# Altium schematic sheet S3P.SchDoc
size 297 x 209 mm
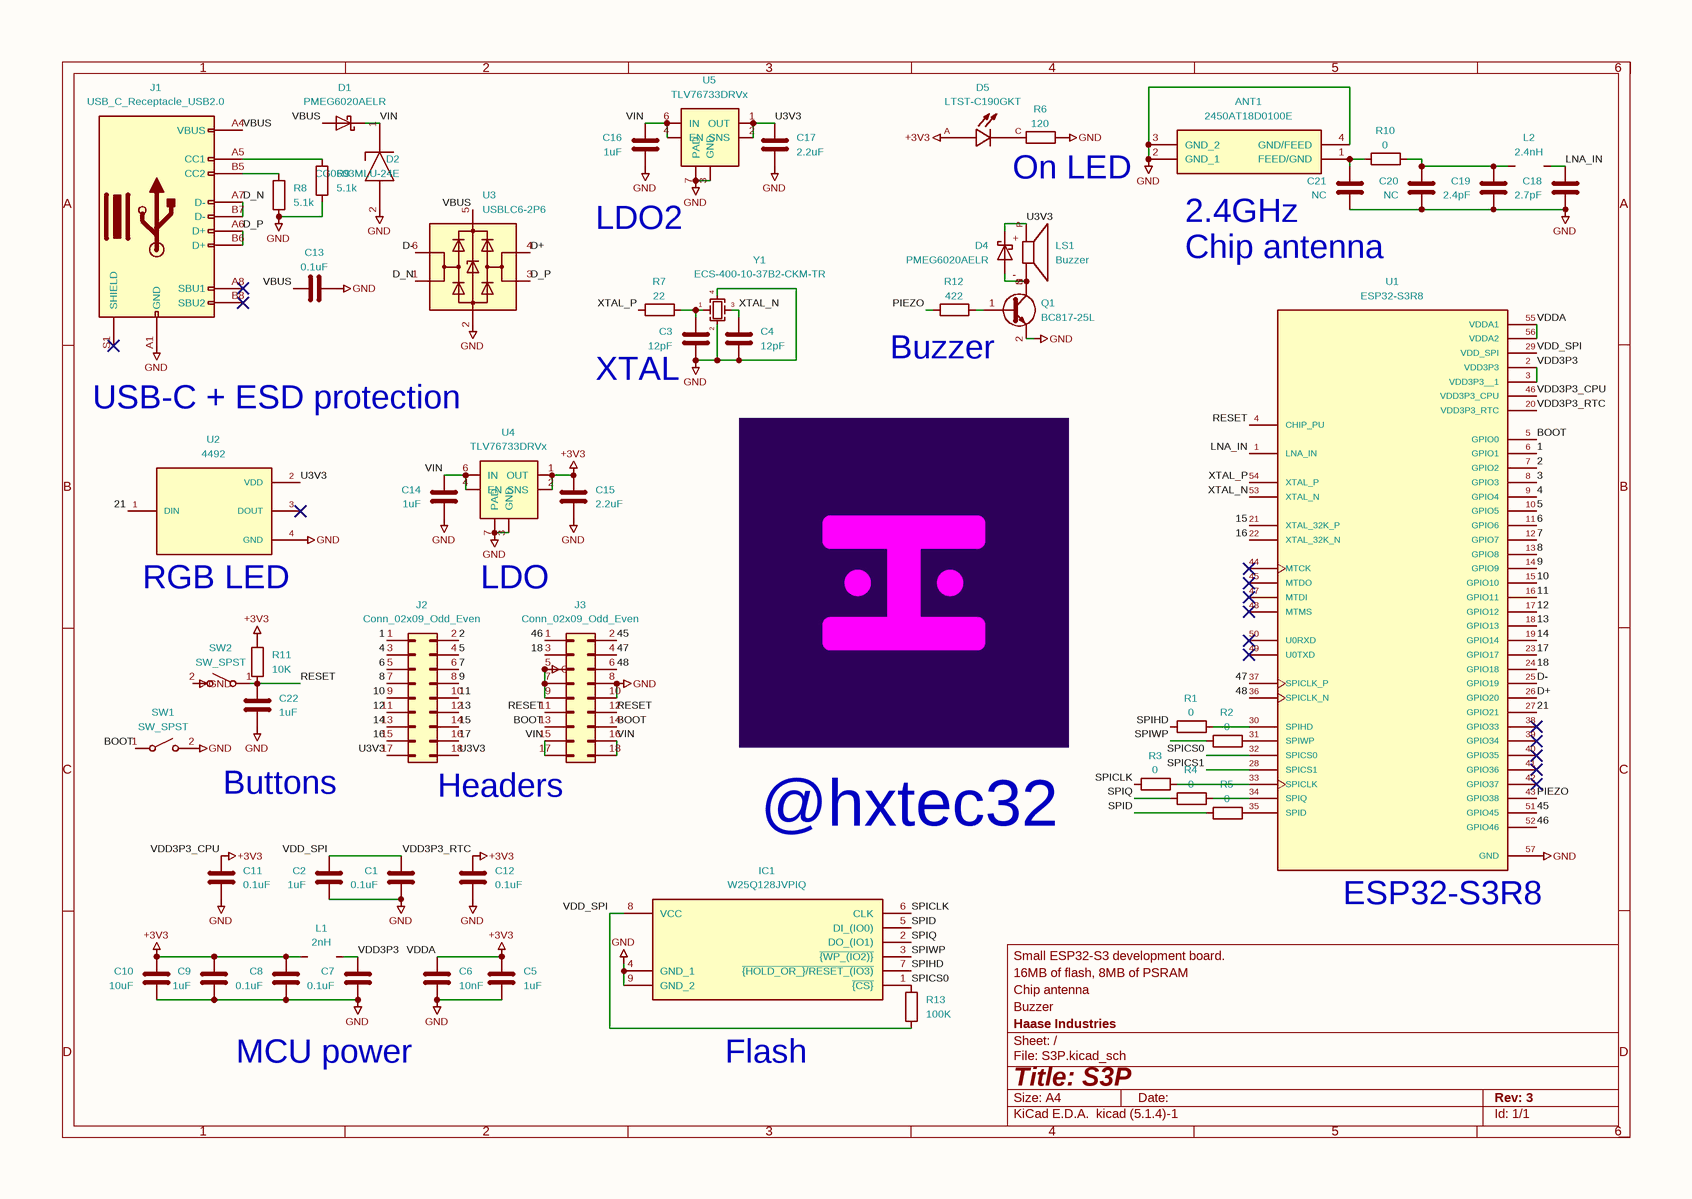
[diagram p0: S3P.SchDoc]

## Parts
ANT1  2450AT18D0100E  [2450AT18D0100E]
C1  0.1uF  [R_0402_1005Metric]
C2  1uF  [R_0402_1005Metric]
C3  12pF  [R_0201_0603Metric]
C4  12pF  [R_0201_0603Metric]
C5  1uF  [R_0402_1005Metric]
C6  10nF  [R_0201_0603Metric]
C7  0.1uF  [R_0402_1005Metric]
C8  0.1uF  [R_0402_1005Metric]
C9  1uF  [R_0402_1005Metric]
C10  10uF  [R_0603_1608Metric]
C11  0.1uF  [R_0402_1005Metric]
C12  0.1uF  [R_0402_1005Metric]
C13  0.1uF  [R_0402_1005Metric]
C14  1uF  [R_0603_1608Metric]
C15  2.2uF  [R_0402_1005Metric]
C16  1uF  [R_0603_1608Metric]
C17  2.2uF  [R_0402_1005Metric]
C18  2.7pF  [R_0201_0603Metric]
C19  2.4pF  [R_0201_0603Metric]
C20  NC  [R_0201_0603Metric]
C21  NC  [R_0201_0603Metric]
C22  1uF  [R_0402_1005Metric]
D1  PMEG6020AELR  [Nexperia_CFP3_SOD-123W]
D2  CG0603MLU-24E  [DIONC1608X55N]
D4  PMEG6020AELR  [Nexperia_CFP3_SOD-123W]
D5  LTST-C190GKT  [LEDC1608X35N]
IC1  W25Q128JVPIQ  [SON127P600X500X80-9N-D]
J1  USB_C_Receptacle_USB2.0  [USB_C_Receptacle_GCT_USB4105-xx-A_16P_TopMnt_Horizontal]
J2  Conn_02x09_Odd_Even  [PinHeader_2x09_P2.54mm_Vertical]
J3  Conn_02x09_Odd_Even  [PinHeader_2x09_P2.54mm_Vertical]
L1  2nH  [L_0402_1005Metric]
L2  2.4nH  [L_0201_0603Metric]
LS1  Buzzer  [XDCR_CMT-0525-75-SMT-TR]
Q1  BC817-25L  [SOT-23]
R1  0  [R_0201_0603Metric]
R2  0  [R_0201_0603Metric]
R3  0  [R_0201_0603Metric]
R4  0  [R_0201_0603Metric]
R5  0  [R_0201_0603Metric]
R6  120  [R_0402_1005Metric]
R7  22  [R_0402_1005Metric]
R8  5.1k  [R_0402_1005Metric]
R9  5.1k  [R_0402_1005Metric]
R10  0  [R_0201_0603Metric]
R11  10K  [R_0402_1005Metric]
R12  422  [R_0402_1005Metric]
R13  100K  [R_0201_0603Metric]
SW1  SW_SPST  [SW_SPST_PTS810]
SW2  SW_SPST  [SW_SPST_PTS810]
U1  ESP32-S3R8  [QFN40P700X700X90-57N-D]
U2  4492  [SK6805-EC15]
U3  USBLC6-2P6  [SOT-666]
U4  TLV76733DRVx  [WSON-6-1EP_2x2mm_P0.65mm_EP1x1.6mm_ThermalVias]
U5  TLV76733DRVx  [WSON-6-1EP_2x2mm_P0.65mm_EP1x1.6mm_ThermalVias]
Y1  ECS-400-10-37B2-CKM-TR  [Crystal_SMD_2016-4Pin_2.0x1.6mm]

## Nets
GND: ANT1.2(GND_1) ANT1.3(GND_2) ANT1.4(GND/FEED) C1.2 C2.2 C3.2 C4.2 C5.2 C6.2 C7.2 C8.2 C9.2 C10.2 C11.2 C12.2 C13.2 C14.2 C15.2 C16.2 C17.2 C18.2 C19.2 C20.2 C21.2 C22.2 D2.2(A) IC1.4(GND_1) IC1.9(GND_2) J1.A1(GND) J3.5(Pin_5) J3.7(Pin_7) J3.8(Pin_8) J3.9(Pin_9) J3.10(Pin_10) Q1.2(E) R6.2 R8.2 R9.2 SW1.2(B) SW2.2(B) U1.57(GND) U2.4(GND) U3.2(GND) U4.3(GND) U4.7(PAD) U5.3(GND) U5.7(PAD) Y1.2 Y1.4
VDD3P3_CPU: C5.1 C6.1 C8.1 C9.1 C10.1 C11.1 C12.1 C15.1 D5.A L1.2 R11.1 U1.20(VDD3P3_RTC) U1.46(VDD3P3_CPU) U1.55(VDDA1) U1.56(VDDA2) U4.1(OUT) U4.2(SNS)  [also labelled +3V3, VDD3P3_RTC, VDDA]
1: J2.1(Pin_1) U1.6(GPIO1)
2: J2.2(Pin_2) U1.7(GPIO2)
3: U1.8(GPIO3)
4: J2.3(Pin_3) U1.9(GPIO4)
5: J2.4(Pin_4) U1.10(GPIO5)
6: J2.5(Pin_5) U1.11(GPIO6)
7: J2.6(Pin_6) U1.12(GPIO7)
8: J2.7(Pin_7) U1.13(GPIO8)
9: J2.8(Pin_8) U1.14(GPIO9)
10: J2.9(Pin_9) U1.15(GPIO10)
11: J2.10(Pin_10) U1.16(GPIO11)
12: J2.11(Pin_11) U1.17(GPIO12)
13: J2.12(Pin_12) U1.18(GPIO13)
14: J2.13(Pin_13) U1.19(GPIO14)
15: J2.14(Pin_14) U1.21(XTAL_32K_P)
16: J2.15(Pin_15) U1.22(XTAL_32K_N)
17: J2.16(Pin_16) U1.23(GPIO17)
18: J3.3(Pin_3) U1.24(GPIO18)
21: U1.27(GPIO21) U2.1(DIN)
45: J3.2(Pin_2) U1.51(GPIO45)
46: J3.1(Pin_1) U1.52(GPIO46)
47: J3.4(Pin_4) U1.37(SPICLK_P)
48: J3.6(Pin_6) U1.36(SPICLK_N)
BOOT: J3.13(Pin_13) J3.14(Pin_14) SW1.1(A) U1.5(GPIO0)
D+: U1.26(GPIO20) U3.4(I/O2)
D-: U1.25(GPIO19) U3.6(I/O1)
D_N: J1.A7(D-) J1.B7(D-) U3.1(I/O1)
D_P: J1.A6(D+) J1.B6(D+) U3.3(I/O2)
LNA_IN: C18.1 L2.1 U1.1(LNA_IN)
PIEZO: R12.1 U1.43(GPIO38)
RESET: C22.1 J3.11(Pin_11) J3.12(Pin_12) R11.2 SW2.1(A) U1.4(CHIP_PU)
SPICLK: IC1.6(CLK) R3.1
SPICS0: IC1.1(~{{CS}}) R13.1 U1.32(SPICS0)
SPICS1: U1.28(SPICS1)
SPID: IC1.5(DI_(IO0)) R5.1
SPIHD: IC1.7(~{{HOLD_OR_}/RESET_(IO3)}) R1.1
SPIQ: IC1.2(DO_(IO1)) R4.1
SPIWP: IC1.3(~{{WP_(IO2)}}) R2.1
U3V3: C17.1 D4.1(K) J2.17(Pin_17) J2.18(Pin_18) LS1.P U2.2(VDD) U5.1(OUT) U5.2(SNS)
VBUS: C13.1 D1.2(A) J1.A4(VBUS) U3.5(VBUS)
VDD3P3: C7.1 L1.1 U1.2(VDD3P3) U1.3(VDD3P3__1)
VDD_SPI: C1.1 C2.1 IC1.8(VCC) R13.2 U1.29(VDD_SPI)
VIN: C14.1 C16.1 D1.1(K) D2.1(K) J3.15(Pin_15) J3.16(Pin_16) J3.17(Pin_17) J3.18(Pin_18) U4.4(EN) U4.6(IN) U5.4(EN) U5.6(IN)
XTAL_N: C4.1 U1.53(XTAL_N) Y1.3
XTAL_P: R7.1 U1.54(XTAL_P)
NetANT1_1: ANT1.1(FEED/GND) C21.1 R10.2
NetC3_1: C3.1 R7.2 Y1.1
NetC19_1: C19.1 C20.1 L2.2 R10.1
NetD4_2: D4.2(A) LS1.N Q1.3(C)
NetD5_C: D5.C R6.1
NetJ1_A5: J1.A5(CC1) R9.1
NetJ1_B5: J1.B5(CC2) R8.1
NetQ1_1: Q1.1(B) R12.2
NetR1_2: R1.2 U1.30(SPIHD)
NetR2_2: R2.2 U1.31(SPIWP)
NetR3_2: R3.2 U1.33(SPICLK)
NetR4_2: R4.2 U1.34(SPIQ)
NetR5_2: R5.2 U1.35(SPID)

Not connected (* = marked no-connect by the designer): J1 A8(SBU1)* A9(VBUS) A12(GND) B1(GND) B4(VBUS) B8(SBU2)* B9(VBUS) B12(GND) S1(SHIELD)*; U1 38(GPIO33)* 39(GPIO34)* 40(GPIO35)* 41(GPIO36)* 42(GPIO37)* 44(MTCK)* 45(MTDO)* 47(MTDI)* 48(MTMS)* 49(U0TXD)* 50(U0RXD)*; U2 3(DOUT)*; U4 5(GND); U5 5(GND)

## Notes on the sheet
- On LED
- LDO2
- Chip antenna
- (near ANT1) 2.4GHz
- Buzzer
- USB-C + ESD protection
- XTAL
- (near U2) RGB LED
- LDO
- Buttons
- Headers
- @hxtec32
- (near U1) ESP32-S3R8
- MCU power
- (near IC1) Flash
- 1
- 2
- 3
- 4
- 5
- 6
- A
- B
- C
- 16MB of flash, 8MB of PSRAM
- Small ESP32-S3 development board.
- D
- Title: S3P
- File: S3P.kicad_sch
- Sheet: /
- Haase Industries
- KiCad E.D.A.  kicad (5.1.4)-1
- Size: A4
- Date:
- Rev: 3
- Id: 1/1
- (in symbol CMT-0525-75-SMT-TR) +; -

## Library data of the parts
ANT1 = 2450AT18D0100E: Manufacturer_Name: JOHANSON TECHNOLOGY; Height: 1.3; Manufacturer_Part_Number: 2450AT18D0100E; Mouser Part Number: 609-2450AT18D0100E; Mouser Price/Stock: https://www.mouser.co.uk/ProductDetail/Johanson-Technology/2450AT18D0100E?qs=qF3SSroohZVORJMmZ%252BHKHQ%3D%3D; Arrow Part Number: 2450AT18D0100E; Arrow Price/Stock: https://www.arrow.com/en/products/2450at18d0100e/johanson-dielectrics?region=nac; Value: 2450AT18D0100E
C1-C22 = C
  C1 C7 C8 C11-C13: Value: 0.1uF; Footprint: Resistor_SMD:R_0402_1005Metric
  C2 C5 C9 C22: Value: 1uF; Footprint: Resistor_SMD:R_0402_1005Metric
  C3 C4: Value: 12pF; Footprint: Resistor_SMD:R_0201_0603Metric
  C6: Value: 10nF; Footprint: Resistor_SMD:R_0201_0603Metric
  C10: Value: 10uF; Footprint: Resistor_SMD:R_0603_1608Metric
  C14 C16: Value: 1uF; Footprint: Resistor_SMD:R_0603_1608Metric
  C15 C17: Value: 2.2uF; Footprint: Resistor_SMD:R_0402_1005Metric
  C18: Value: 2.7pF; Footprint: Resistor_SMD:R_0201_0603Metric
  C19: Value: 2.4pF; Footprint: Resistor_SMD:R_0201_0603Metric
  C20 C21: Value: NC; Footprint: Resistor_SMD:R_0201_0603Metric
D2 = CG0603MLU-24E: Manufacturer_Name: Bourns; Height: 0.55; Manufacturer_Part_Number: CG0603MLU-24E; Mouser Part Number: 652-CG0603MLU-24E; Mouser Price/Stock: https://www.mouser.co.uk/ProductDetail/Bourns/CG0603MLU-24E?qs=m8myXnDJXpWyvsqQ2sWN8w%3D%3D; Arrow Part Number: CG0603MLU-24E; Arrow Price/Stock: https://www.arrow.com/en/products/cg0603mlu-24e/bourns?region=nac; Value: CG0603MLU-24E
D5 = LTST-C190GKT: MF: Lite-On Inc.; DESCRIPTION: Green 571nm LED Indication - Discrete 2V 0603 (1608 Metric); Description: \nGreen 569nm LED Indication - Discrete 2.1V 0603 (1608 Metric)\n; PACKAGE: 0603 Lite-On; PRICE: None; Package: 0603 Lite-On; Check_prices: https://www.snapeda.com/parts/LTST-C190GKT/Lite-On+Inc./view-part/?ref=eda; Price: None; SnapEDA_Link: https://www.snapeda.com/parts/LTST-C190GKT/Lite-On+Inc./view-part/?ref=snap; MP: LTST-C190GKT; Purchase-URL: https://www.snapeda.com/api/url_track_click_mouser/?unipart_id=46935&manufacturer=Lite-On Inc.&part_name=LTST-C190GKT&search_term=ltst-c190gkt; Availability: In Stock; AVAILABILITY: In Stock; PURCHASE-URL: https://pricing.snapeda.com/search/part/LTST-C190GKT/?ref=eda; Value: LTST-C190GKT; Footprint: LTST-C190GKT:LEDC1608X35N
IC1 = W25Q128JVPIQ: Manufacturer_Name: Winbond; Height: 0.8; Manufacturer_Part_Number: W25Q128JVPIQ; Mouser Part Number: 454-W25Q128JVPIQ; Mouser Price/Stock: https://www.mouser.co.uk/ProductDetail/Winbond/W25Q128JVPIQ?qs=qSfuJ%252Bfl%2Fd676hAD%252B1JSfw%3D%3D; Arrow Part Number: W25Q128JVPIQ; Arrow Price/Stock: https://www.arrow.com/en/products/w25q128jvpiq/winbond-electronics?region=nac; Value: W25Q128JVPIQ
L1 L2 = L
  L1: Value: 2nH; Footprint: Inductor_SMD:L_0402_1005Metric
  L2: Value: 2.4nH; Footprint: Inductor_SMD:L_0201_0603Metric
LS1 = CMT-0525-75-SMT-TR: MANUFACTURER: CUI Inc.; MF: CUI Devices; Description: 5 mm, 3 Vo-p, 75 dB, Surface Mount (SMT), Magnetic Audio Transducer Buzzer; MAXIMUM_PACKAGE_HEIGHT: 2.80mm; Package: CUI Devices; Price: None; Check_prices: https://www.snapeda.com/parts/CMT-0525-75-SMT-TR/CUI+Devices/view-part/?ref=eda; STANDARD: Manufacturer Recommendations; PARTREV: 1.0; SnapEDA_Link: https://www.snapeda.com/parts/CMT-0525-75-SMT-TR/CUI+Devices/view-part/?ref=snap; MP: CMT-0525-75-SMT-TR; Purchase-URL: https://www.snapeda.com/api/url_track_click_mouser/?unipart_id=3662534&manufacturer=CUI Devices&part_name=CMT-0525-75-SMT-TR&search_term=cmt-0525-75-smt-tr; CUI_purchase_URL: https://www.cuidevices.com/product/audio/buzzers/audio-transducers/cmt-0525-75-smt-tr?utm_source=snapeda.com&utm_medium=referral&utm_campaign=snapedaBOM; Availability: In Stock; Value: Buzzer; Footprint: CMT-0525-75-SMT-TR:XDCR_CMT-0525-75-SMT-TR
Q1 = BC817: Value: BC817-25L; Footprint: Package_TO_SOT_SMD:SOT-23
R1-R13 = R
  R1-R5 R10: Value: 0; Footprint: Resistor_SMD:R_0201_0603Metric
  R6: Value: 120; Footprint: Resistor_SMD:R_0402_1005Metric
  R7: Value: 22; Footprint: Resistor_SMD:R_0402_1005Metric
  R8 R9: Value: 5.1k; Footprint: Resistor_SMD:R_0402_1005Metric
  R11: Value: 10K; Footprint: Resistor_SMD:R_0402_1005Metric
  R12: Value: 422; Footprint: Resistor_SMD:R_0402_1005Metric
  R13: Value: 100K; Footprint: Resistor_SMD:R_0201_0603Metric
U1 = ESP32-S3R8: MF: Espressif Systems; Description: \nIC RF TxRx + MCU Bluetooth, WiFi 802.11b/g/n, Bluetooth v5.0 2.412GHz ~ 2.484GHz 56-VFQFN Exposed Pad\n; Package: None; Price: None; Check_prices: https://www.snapeda.com/parts/ESP32-S3R8/Espressif+Systems/view-part/?ref=eda; SnapEDA_Link: https://www.snapeda.com/parts/ESP32-S3R8/Espressif+Systems/view-part/?ref=snap; MP: ESP32-S3R8; Availability: In Stock; Purchase-URL: https://www.snapeda.com/api/url_track_click_mouser/?unipart_id=9754695&manufacturer=Espressif Systems&part_name=ESP32-S3R8&search_term=esp32-s3r8; Value: ESP32-S3R8; Footprint: ESP32-S2:QFN40P700X700X90-57N-D
U2 = 4492: MANUFACTURER: Adafruit Industries; MF: Adafruit; Description: \nAdafruit Accessories NeoPixel Addressable 1515 LEDs (1.5mm x 1.5mm) - 10 pack - SK6805-E-J\n; MAXIMUM_PACKAGE_HEIGHT: 0.65 mm; Package: None; Price: None; Check_prices: https://www.snapeda.com/parts/4492/Adafruit+Industries/view-part/?ref=eda; STANDARD: Manufacturer Recommendations; PARTREV: 14/10/19; SnapEDA_Link: https://www.snapeda.com/parts/4492/Adafruit+Industries/view-part/?ref=snap; MP: 4492; Availability: In Stock; Value: 4492; Footprint: SK6805-EC15:SK6805-EC15
Y1 = Crystal_GND24_Small: Value: ECS-400-10-37B2-CKM-TR; Footprint: Crystal:Crystal_SMD_2016-4Pin_2.0x1.6mm
D1 D4 = PMEG6020AELR: Value: PMEG6020AELR; Footprint: Diode_SMD:Nexperia_CFP3_SOD-123W
J1 = USB_C_Receptacle_USB2.0: Value: USB_C_Receptacle_USB2.0; Footprint: Connector_USB:USB_C_Receptacle_GCT_USB4105-xx-A_16P_TopMnt_Horizontal
J2 J3 = Conn_02x09_Odd_Even: Value: Conn_02x09_Odd_Even; Footprint: Connector_PinHeader_2.54mm:PinHeader_2x09_P2.54mm_Vertical
SW1 SW2 = SW_SPST: Value: SW_SPST; Footprint: Button_Switch_SMD:SW_SPST_PTS810
U3 = USBLC6-2P6: Value: USBLC6-2P6; Footprint: Package_TO_SOT_SMD:SOT-666
U4 U5 = TLV76733DRVx: Value: TLV76733DRVx; Footprint: Package_SON:WSON-6-1EP_2x2mm_P0.65mm_EP1x1.6mm_ThermalVias